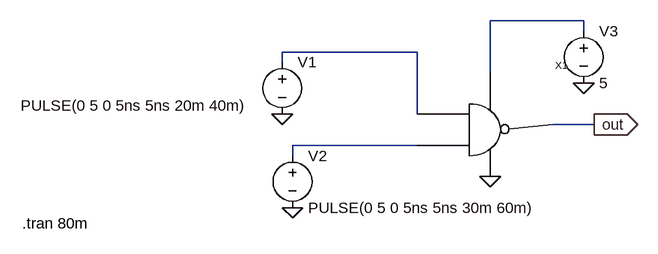
[diagram p0: schematic nandgateimplytesting.asc]
nandgateimplytesting.asc, the LTspice schematic file:
Version 4
SHEET 1 880 680
WIRE 368 0 224 0
WIRE 368 16 368 0
WIRE 112 48 -96 48
WIRE -96 64 -96 48
WIRE 224 80 224 0
WIRE 112 144 112 48
WIRE 384 160 320 160
WIRE 112 192 -80 192
WIRE -80 208 -80 192
FLAG 384 160 out
IOPIN 384 160 Out
FLAG 224 240 0
FLAG 368 96 0
FLAG -96 144 0
FLAG -80 288 0
SYMBOL nandgateimply 112 160 R0
SYMATTR InstName X1
SYMBOL voltage -96 48 R0
WINDOW 3 -402 83 Left 2
WINDOW 123 0 0 Left 0
WINDOW 39 0 0 Left 0
SYMATTR InstName V1
SYMATTR Value PULSE(0 5 0 5ns 5ns 20m 40m)
SYMBOL voltage -80 192 R0
WINDOW 123 0 0 Left 0
WINDOW 39 0 0 Left 0
SYMATTR InstName V2
SYMATTR Value PULSE(0 5 0 5ns 5ns 30m 60m)
SYMBOL voltage 368 0 R0
WINDOW 123 0 0 Left 0
WINDOW 39 0 0 Left 0
SYMATTR InstName V3
SYMATTR Value 5
TEXT -496 312 Left 2 !.tran 80m

The netlist it stands for:
* nandgateimplytesting.asc
XX1 N002 N003 N001 0 out nandgateimply  ; pins A B VDD VSS OUT
V1 N002 0 PULSE(0 5 0 5ns 5ns 20m 40m)
V2 N003 0 PULSE(0 5 0 5ns 5ns 30m 60m)
V3 N001 0 5
.tran 80m
.backanno
.end